# EAGLE design uc3906 charger 2 (EAGLE 6.4)
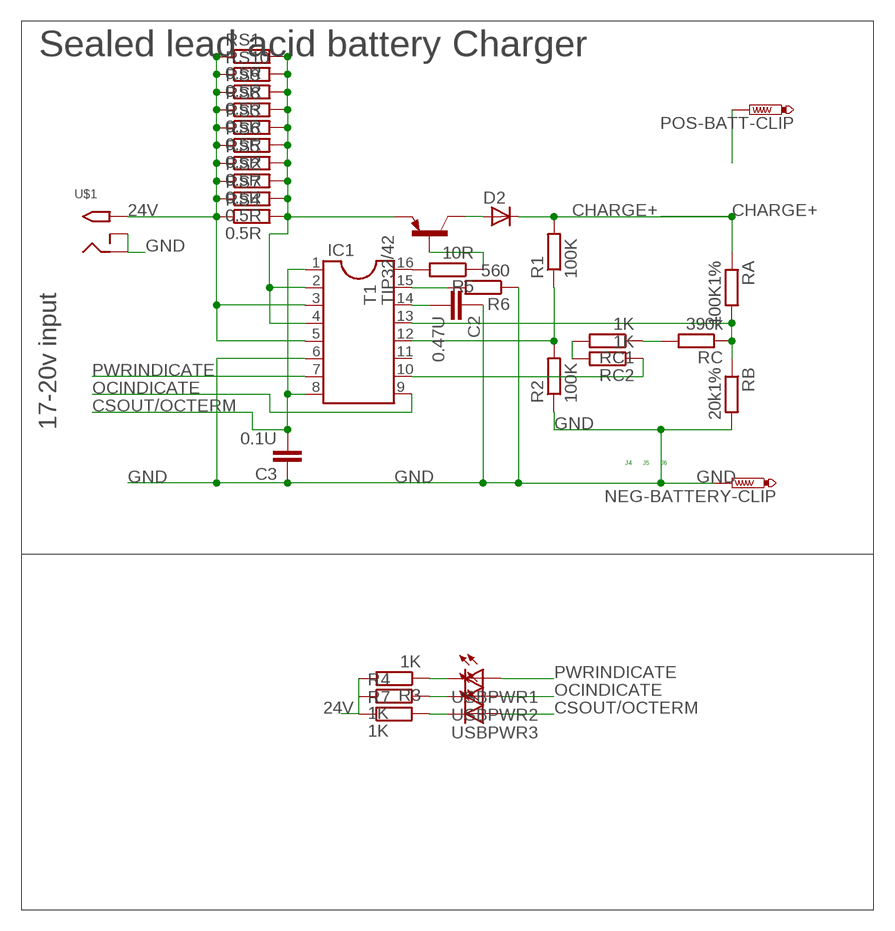
[diagram p0: schematic, sheet 1]

## Parts
C2  0.47U  C-EUC1206  [C1206]
C3  0.1U  C-EUC1206  [C1206]
D2  D-MLL-41  [MELF-MLL41]
IC1  DIL16  [DIL16]
NEG-BATTERY-CLIP  PTR1PAD1-20Y  [P1-20Y]
POS-BATT-CLIP  PTR1PAD1-20Y  [P1-20Y]
R1  100K  R-EU_M1206  [M1206]
R2  100K  R-EU_M1206  [M1206]
R3  1K  R-EU_M1206  [M1206]
R4  1K  R-EU_M1206  [M1206]
R5  10R  R-EU_M1206  [M1206]
R6  560  R-EU_M1206  [M1206]
R7  1K  R-EU_M1206  [M1206]
RA  100K1%  R-EU_M1206  [M1206]
RB  20k1%  R-EU_M1206  [M1206]
RC  390k  R-EU_M1206  [M1206]
RC1  1K  R-EU_M1206  [M1206]
RC2  1K  R-EU_M1206  [M1206]
RS1  0.5R  R-EU_R2512  [R2512]
RS2  0.5R  R-EU_0617/5V  [0617V]
RS3  0.5R  R-EU_R2512  [R2512]
RS4  0.5R  R-EU_0617/5V  [0617V]
RS5  0.5R  R-EU_R2512  [R2512]
RS6  0.5R  R-EU_0617/5V  [0617V]
RS7  0.5R  R-EU_R2512  [R2512]
RS8  0.5R  R-EU_0617/5V  [0617V]
RS9  0.5R  R-EU_R2512  [R2512]
RS10  0.5R  R-EU_R2512  [R2512]
T1  TIP32/42  TIP32C  [TO220]
U$1  2.1MMJACKTHM  [PJ-102A]
USBPWR1  LEDCHIPLED_1206  [CHIPLED_1206]
USBPWR2  LEDCHIPLED_1206  [CHIPLED_1206]
USBPWR3  LEDCHIPLED_1206  [CHIPLED_1206]

## Nets
24V: IC1.3 IC1.5 R3.2 R4.1 R7.1 RS1.1 RS2.1 RS3.1 RS4.1 RS5.1 RS6.1 RS7.1 RS8.1 RS9.1 RS10.1 U$1.TIP
CHARGE+: D2.1(C) POS-BATT-CLIP.TP R1.2 RA.1
CHARGEENABLE: IC1.12 R1.1 R2.2
COMPENSATION: C2.2 IC1.14
CSOUT/OCTERM: C3.2 IC1.1 IC1.8 USBPWR3.A
DRIVERSINK: IC1.16 R5.2
DRIVERSOURCE: IC1.15 R6.2
GND: C2.1 C3.1 IC1.6 NEG-BATTERY-CLIP.TP R2.1 R6.1 RB.2 U$1.RING U$1.RING_SW
IOUT: IC1.2 IC1.4 RS1.2 RS2.2 RS3.2 RS4.2 RS5.2 RS6.2 RS7.2 RS8.2 RS9.2 RS10.2 T1.3(E)
N$1: RC1.1 RC.2
N$2: R3.1 USBPWR1.C
N$3: RC1.2 RC2.2
N$5: R4.2 USBPWR2.C
N$6: R7.2 USBPWR3.C
N$14: R5.1 T1.1(B)
N$15: D2.2(A) T1.2(C)
OCINDICATE: IC1.9 USBPWR2.A
PWRINDICATE: IC1.7 USBPWR1.A
STATELEVELCONTROL: IC1.10 RC2.1
VSENSE: IC1.13 RA.2 RB.1 RC.1
Unconnected: IC1.11

## Notes on the sheet
- Sealed lead acid battery Charger
- 17-20v input
- J4 | J5 | J6

## Library data of the parts
C2 C3 = rcl:C-EU: CAPACITOR, European symbol
D2 = semicon-smd-ipc:D-: DIODE unfilled
IC1 = ic-package:DIL16: Dual In Line / Socket
NEG-BATTERY-CLIP POS-BATT-CLIP = testpad:PTR1: TEST PIN
R1-R7 RA RB RC RC1 RC2 = rcl:R-EU_: RESISTOR, European symbol
RS1-RS10 = resistor:R-EU_: RESISTOR, European symbol
T1 = transistor:TIP32: PNP Transistor Medium Power Linear Switching Applications Source: http://onsemi.com
U$1 = adafruit:2.1MMJACK: 2.1mm x 5.5mm THM DC jack with internal switch. Digikey part #PJ-102A, 4UCON part #05537 2.1mm x 5.5mm SMT DC jack with internal switch. Digikey part #PJ-002A-SMT, 4UCON part #03267 By microbuilder.eu & adafruit.com
USBPWR1-USBPWR3 = RepRapjr:LED: LED OSRAM: - CHIPLED LG R971, LG N971, LY N971, LG Q971, LY Q971, LO R971, LY R971 LH N974, LH R974 LS Q976, LO Q976, LY Q976 LO Q996 - Hyper CHIPLED LW Q18S LB Q993, LB Q99A, LB R99A - SideLED LS A670, LO A670, LY A670, LG A670, LP A670 LB A673, LV A673, LT A673, LW A673 LH A674 LY A675 LS A676, LA A676, LO A676, LY A676, LW A676 LS A679, LY A679, LG A679 - Hyper Micro SIDELED® LS Y876, LA Y876, LO Y876, LY Y876 LT Y87S - SmartLED LW L88C, LW L88S LB L89C, LB L89S, LG L890 LS L89K, LO L89K, LY L89K LS L896, LA L896, LO L896, LY L896 - TOPLED LS T670, LO T670, LY T670, LG T670, LP T670 LSG T670, LSP T670, LSY T670, LOP T670, LYG T670 LG T671, LOG T671, LSG T671 LB T673, LV T673, LT T673, LW T673 LH T674 LS T676, LA T676, LO T676, LY T676, LB T676, LH T676, LSB T676, LW T676 LB T67C, LV T67C, LT T67C, LS T67K, LO T67K, LY T67K, LW E67C LS E67B, LA E67B, LO E67B, LY E67B, LB E67C, LV E67C, LT E67C LW T67C LS T679, LY T679, LG T679 LS T770, LO T770, LY T770, LG T770, LP T770 LB T773, LV T773, LT T773, LW T773 LH T774 LS E675, LA E675, LY E675, LS T675 LS T776, LA T776, LO T776, LY T776, LB T776 LHGB T686 LT T68C, LB T68C - Hyper Mini TOPLED® LB M676 - Mini TOPLED Santana® LG M470 LS M47K, LO M47K, LY M47K Source: http://www.osram.convergy.de LUXEON: - LUMILED® LXK2-PW12-R00, LXK2-PW12-S00, LXK2-PW14-U00, LXK2-PW14-V00 LXK2-PM12-R00, LXK2-PM12-S00, LXK2-PM14-U00 LXK2-PE12-Q00, LXK2-PE12-R00, LXK2-PE12-S00, LXK2-PE14-T00, LXK2-PE14-U00 LXK2-PB12-K00, LXK2-PB12-L00, LXK2-PB12-M00, LXK2-PB14-N00, LXK2-PB14-P00, LXK2-PB14-Q00 LXK2-PR12-L00, LXK2-PR12-M00, LXK2-PR14-Q00, LXK2-PR14-R00 LXK2-PD12-Q00, LXK2-PD12-R00, LXK2-PD12-S00 LXK2-PH12-R00, LXK2-PH12-S00 LXK2-PL12-P00, LXK2-PL12-Q00, LXK2-PL12-R00 Source: www.luxeon.com KINGBRIGHT: KA-3528ASYC Source: www.kingbright.com

## Net classes
1 power: width 0.6 mm, clearance 0.305 mm

## Board
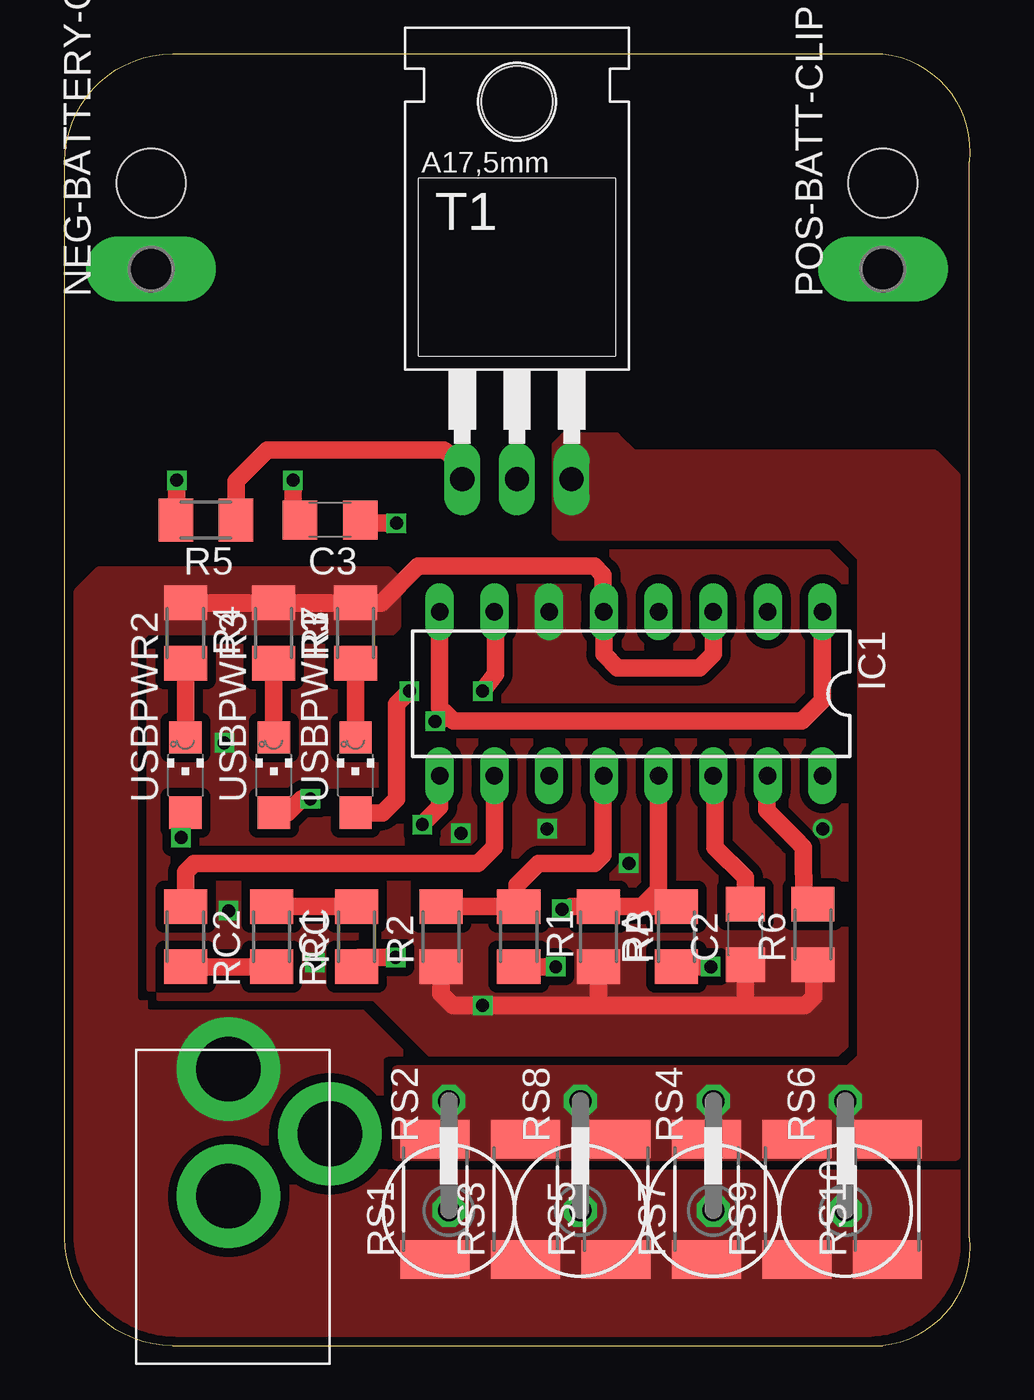
[diagram p1: board, top side]
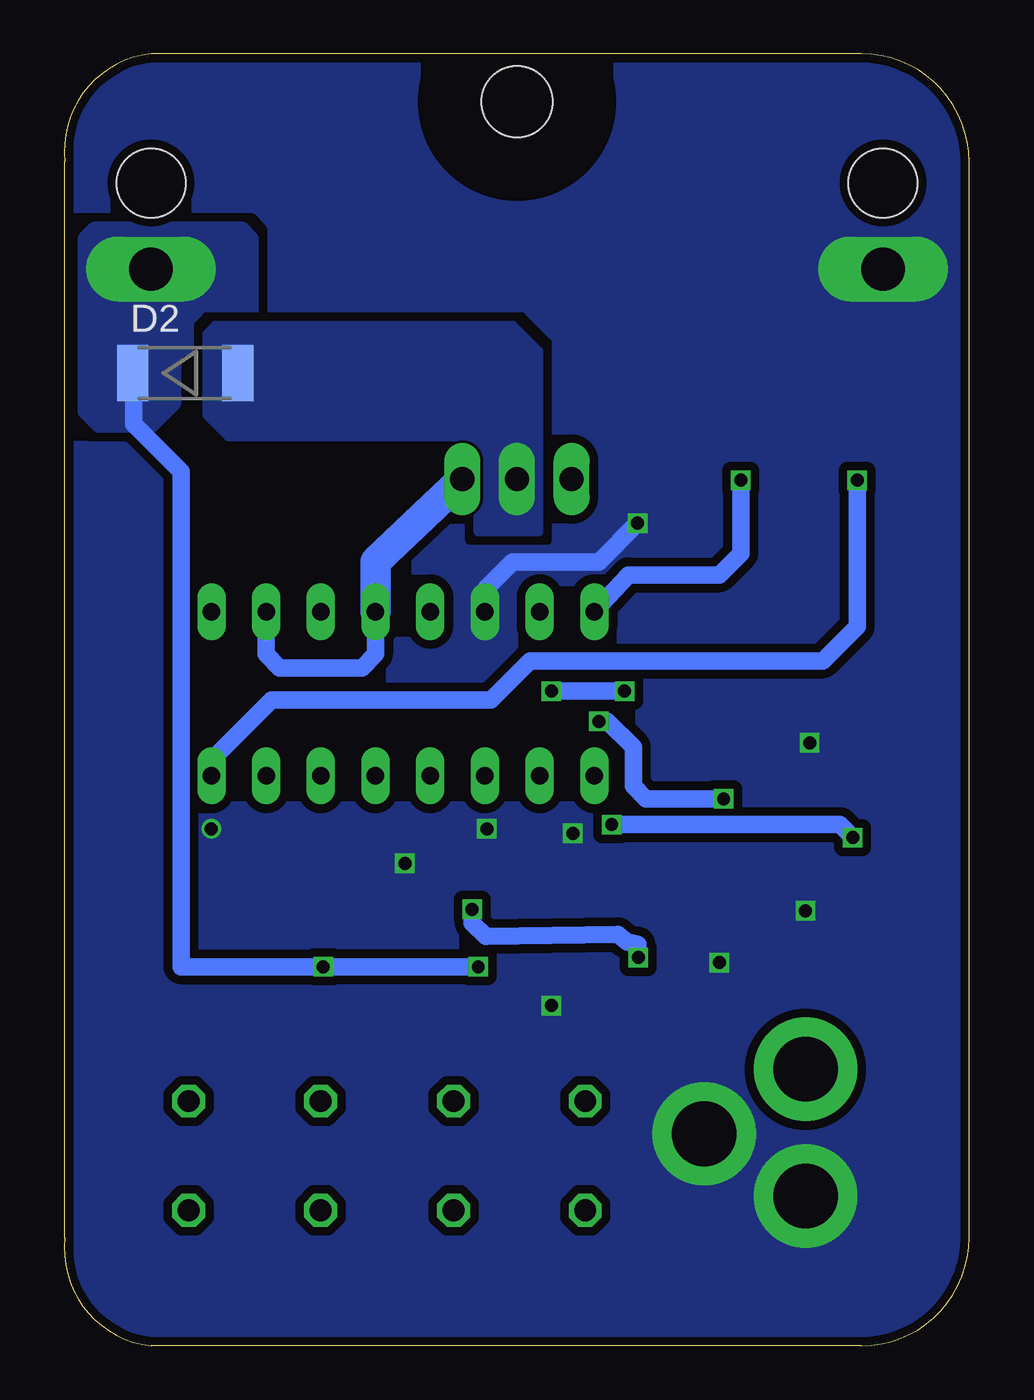
[diagram p2: board, bottom side, seen from below]

Size 42.03 x 60 mm. Coordinates in mm from the lower left corner, seen from the top.
Outline: 0,5 0,55 arc-90 5,60 38,60 arc-90 42,55 42,5 arc-90 38,0 5,0 arc-90 0,5
Copper layers (1*16): Top 0.035mm / dielectric 1.5mm / Bottom 0.035mm
Design rules "dirt_cheap_dirty_boards.v1": minimum track width 5mil, minimum drill 12mil, track to track 5mil, track to pad 5mil, pad to pad 5mil, via to via 5mil, smd to smd 0mil, copper to edge 10mil, drill to drill 10mil, minimum pad ring 10mil, minimum via ring 6mil, stop-mask expansion 2mil, vias tented up to drill 25mil, thermal gap 10mil
Holes 3.2 mm at 4,54 38,54

### Footprints (pad centres in the part's own frame; a part is rotated, then mirrored left to right if it is on the bottom)
C1206 = smd 1.6 x 1.8: 1 -1.4,0; 2 1.4,0
MELF-MLL41 = smd 1.45 x 2.6: 1 -2.445,0; 2 2.445,0
DIL16 = drill 0.813 long: 1 -8.89,-3.81; 2 -6.35,-3.81; 3 -3.81,-3.81; 4 -1.27,-3.81; 5 1.27,-3.81; 6 3.81,-3.81; 7 6.35,-3.81; 8 8.89,-3.81; 9 8.89,3.81; 10 6.35,3.81; 11 3.81,3.81; 12 1.27,3.81; 13 -1.27,3.81; 14 -3.81,3.81; 15 -6.35,3.81; 16 -8.89,3.81
P1-20Y = drill 2.007 pad 2.54 long: TP 0,0
M1206 = smd 1.6 x 2: 1 -1.4,0; 2 1.4,0
R2512 = smd 1.8 x 3.2: 1 -2.8,0; 2 2.8,0
0617V = drill 1.016 octagon: 1 -2.54,0; 2 2.54,0
TO220 = drill 1.118 long: 1 -2.54,-6.35; 2 0,-6.35; 3 2.54,-6.35 | hole 3.302: 0,11.176
PJ-102A = drill 3 pad 4.8: RING 0.1,-3.39; RING_SW -4.6,-6.29; TIP 0.1,-9.29
CHIPLED_1206 = smd 1.5 x 1.5: A 0,-1.75; C 0,1.75

### Placement (x,y rotation side)
C2  31.61,19.1 90 top
C3  12.32,38.35 180 top
D2  36.41,45.17 0 bottom
IC1  26.3,30.28 180 top
NEG-BATTERY-CLIP  4,50 90 top
POS-BATT-CLIP  38,50 90 top
R1  21.08,19 270 top
R2  17.47,19 90 top
R3  13.5,33.1 90 top
R4  5.6,33.1 270 top
R5  6.55,38.35 180 top
R6  34.74,19.1 90 top
R7  9.7,33.1 270 top
RA  28.4,19 90 top
RB  24.79,19 270 top
RC  13.54,19 90 top
RC1  9.6,19 270 top
RC2  5.6,19 270 top
RS1  17.2,6.8 90 top
RS2  17.83,8.82 90 top
RS3  21.4,6.8 90 top
RS4  30.12,8.82 90 top
RS5  25.6,6.8 90 top
RS6  36.25,8.82 90 top
RS7  29.8,6.8 90 top
RS8  23.94,8.82 90 top
RS9  34,6.8 90 top
RS10  38.2,6.8 90 top
T1  21,46.6 0 top
U$1  7.7,3.55 180 top
USBPWR1  13.5,26.5 0 top
USBPWR2  5.6,26.5 0 top
USBPWR3  9.7,26.5 0 top

### Tracks (layer width: path | path; a pad name or v marks a point on that pad's centre or on a via)
24V
  Top 0.813: IC1.3 30.11,32.12 29.48,31.48 25.67,31.48 25.03,32.12 IC1.5 25,34.12 25,35.8 24.6,36.2 16.4,36.2 14.7,34.5 R3.2 R7.1 R4.1
  pour Top (isolate 0.406, rank 6, no thermals): 16.8,8.2 41.4,8.2 41.4,5 arc-90 37.4,0.6 5.2,0.6 arc-90 0.6,5.2 0.6,35 1.6,36 15,36 15.4,35.6 15.4,33.4 15.2,33.2 3.8,33.2 3.2,32.6 3.2,21.8 4.2,20.8 4.2,16 13.2,16 16.2,13 16.2,8.8
CHARGE+  (via drill 0.6)
  Top 0.813: R1.2 v22.8,17.6 | v30,17.6 RA.1
  Bottom 0.813: v22.8,17.6 v30,17.6 36.6,17.6 36.6,40.6 38.8,42.8 38.8,45.11 D2.1
  pour Bottom (isolate 0.406, rank 2, no thermals): 33.4,51.4 33.4,47.2 34.2,46.4 36.6,46.4 37,46 37,43.8 38,42.8 40.4,42.8 41,43.4 41,51.4 40.6,51.8 33.8,51.8
CHARGEENABLE
  Top 0.813: R2.2 R1.1 21,20.48 21,21.4 22,22.4 24.6,22.4 25,22.8 25,25.75 25.2,25.95 25.2,26.3 IC1.12
COMPENSATION
  Top 0.813: C2.2 31.61,21.74 30.2,23.15 30.2,26.38 IC1.14
CSOUT/OCTERM  (via drill 0.6)
  Top 0.813: IC1.1 35.19,29.96 34.24,29.01 18.05,29.01 17.73,29.33 | 17.73,29.33 17.41,29.64 IC1.8 17.4,34.1 | USBPWR3.A 10.35,24.75 11,25.4 v11.4,25.4 | v17.2,29 17.4,29 17.73,29.33 | v10.6,40.2 10.6,38.47 C3.2
  Bottom 0.813: v11.4,25.4 15,25.4 15.6,26 15.6,27.8 16.8,29 v17.2,29 | v10.6,40.2 10.6,36.8 11.6,35.8 15.8,35.8 15.81,35.79 IC1.8
DRIVERSINK  (via drill 0.6)
  Top 0.813: v5.2,40.2 5.2,39.7 R5.2
  Bottom 0.813: IC1.16 35.19,27.21 32.4,30 22.2,30 20.4,31.8 6.8,31.8 5.2,33.4 v5.2,40.2
DRIVERSOURCE
  Top 0.813: R6.2 34.35,20.7 34.3,22.25 34.3,23.15 33.92,23.52 33.6,23.85 32.6,24.85 32.6,26.42 IC1.15
GND  (via drill 0.6)
  Top 0.813: R2.1 17.47,16.33 18,15.8 v19.4,15.8 24.6,15.8 | 24.6,15.8 31.4,15.8 | 31.4,15.8 34.4,15.8 34.8,16.2 34.8,17.64 R6.1 | C2.1 31.61,16.01 31.4,15.8 | RB.2 24.79,15.99 24.6,15.8 | v15.4,38.2 13.67,38.2 C3.1
  Bottom 0.813: IC1.6 22.49,35.11 21.2,36.4 17.2,36.4 v15.4,38.2
  other vias: 7.4,28 11.6,17.8 22.4,24 26.2,22.4 18.4,23.8 7.6,20.2 35.2,24
  pour Bottom (isolate 0.406, rank 5, no thermals): 0.6,-0.6 32.6,0 43,-1 43,65 -1,65 -1,-1
  pour Top (isolate 0.406, rank 5, no thermals): 4,32.2 4.2,32.4 15.6,32.4 16,32.8 16,35.6 17.2,36.8 35.6,36.8 36.2,36.2 36.2,13.8 36,13.6 17,13.6 14.4,16.2 4.4,16.2 4,16.6
IOUT
  Bottom 0.813: IC1.4 27.57,32.12 28.21,31.48 32.02,31.48 32.65,32.12 IC1.2
  Bottom 1.422: IC1.4 27.57,36.42 T1.3
  pour Top (no thermals): 15.4,12.8 15.4,8.8 41.4,8.8 41.4,40.4 40.4,41.4 26.4,41.4 25.6,42.2 23.2,42.2 22.8,41.8 22.8,37.8 23,37.6 36,37.6 37,36.6 37,13.4 36.4,12.8
N$1
  Top 0.813: RC.2 RC1.1
N$2
  Top 0.813: USBPWR1.C R3.1
N$3
  Top 0.813: RC1.2 RC2.2
N$5
  Top 0.813: USBPWR2.C R4.2
N$6
  Top 0.813: USBPWR3.C R7.2
N$14
  Top 0.813: R5.1 7.95,40.15 9.4,41.6 17.6,41.6 18.4,41 18.4,40.31 T1.1
N$15
  pour Bottom (no thermals): 22.8,37.8 22.8,41.8 23.2,42.2 34.4,42.2 35.4,43.2 35.4,47 35,47.4 21.2,47.4 20,46.2 20,37.8
OCINDICATE  (via drill 0.6)
  Top 0.813: IC1.9 17.41,25.01 v16.6,24.2 | v5.4,23.6 5.4,24.55 USBPWR2.A
  Bottom 0.813: v16.6,24.2 6,24.2 v5.4,23.6
PWRINDICATE  (via drill 0.6)
  Top 0.813: USBPWR1.A 14.75,24.75 15.4,25.4 15.4,29.8 v16,30.4 | v19.4,30.4 20,31.2 20,33.84 IC1.7
  Bottom 0.813: v16,30.4 v19.4,30.4
STATELEVELCONTROL
  Top 0.813: IC1.10 19.95,23.15 19.2,22.4 6,22.4 5.6,22 RC2.1
VSENSE  (via drill 0.6)
  Top 0.813: RA.2 26.8,20.4 | 26.8,20.4 RB.1 | RB.1 23.52,20.4 v23.09,20.27 | v15.37,18.03 13.67,18.03 RC.1 | RB.1 24.99,20.45 | IC1.13 27.57,21.17 26.8,20.4
  Bottom 0.813: v23.09,20.27 23.09,19.63 22.45,19 16.32,19.1 15.88,18.76 15.38,18.64 v15.37,18.03

### Text on the board
OHSILK: NEG | POS | 10R | C | 104 | 2K2 | 2K2 | 2K2 | UC3906 | + | + | + | 1K | 1K | 390K | 100K | 100K | 20K | 100K | .47U | 560R